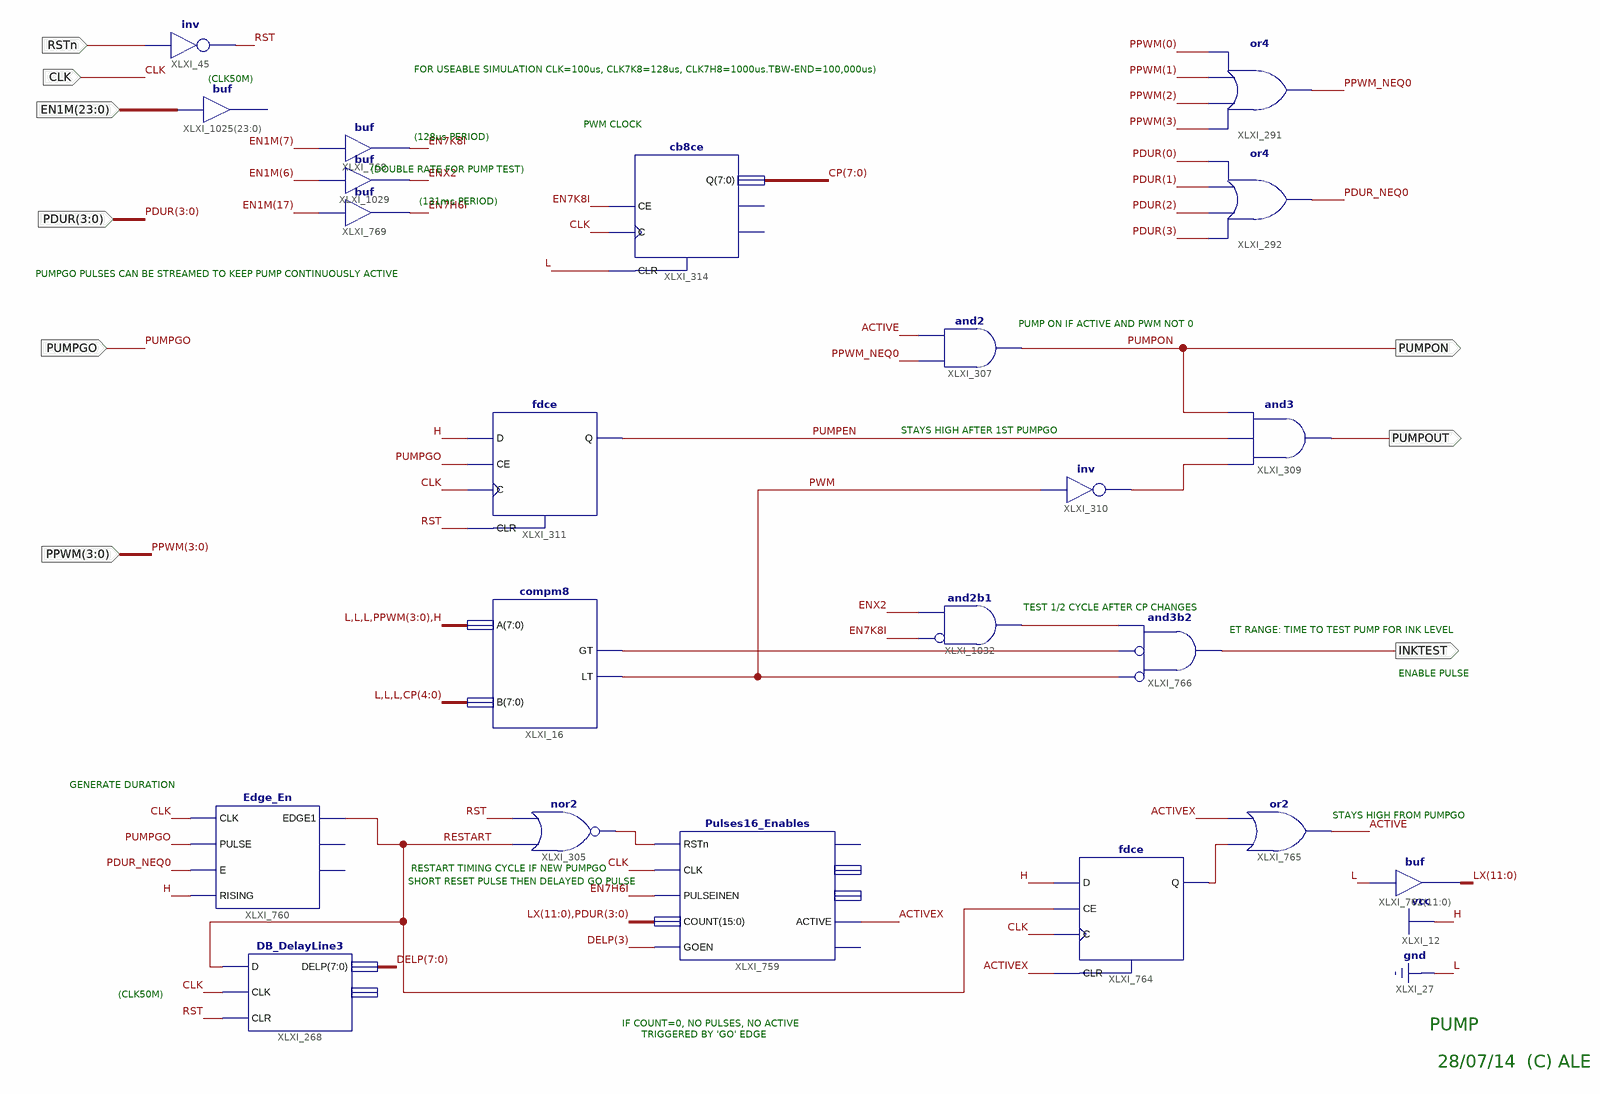
[diagram p0: schematic sheet 1]
// Xilinx ISE schematic DB_Pump.sch (spartan3e) as structural Verilog: 22 symbols, 9 ports
module DB_Pump (
  input  PUMPGO,
  input  [3:0] PDUR,
  input  CLK,
  input  RSTn,
  input  [3:0] PPWM,
  input  [23:0] EN1M,
  output PUMPON,
  output PUMPOUT,
  output INKTEST
);

  wire ACTIVE, ACTIVEX, EN7H6I, EN7K8I, ENX2, PDUR_NEQ0, PPWM_NEQ0, PUMPEN, PWM, RESTART, RST, XLXN_63,
       XLXN_330, XLXN_335, XLXN_336, XLXN_339;
  wire [7:0] CP, DELP;
  wire [11:0] LX;

  not XLXI_45 (RST, RSTn);
  compm8 XLXI_16 (.A({3'b000, PPWM, 1'b1}), .B({3'b000, CP[4:0]}), .GT(XLXN_336), .LT(PWM));
  DB_DelayLine3 XLXI_268 (.CLK(CLK), .CLR(RST), .D(RESTART), .DELP(DELP));  // open: DELN
  nor XLXI_305 (XLXN_330, RESTART, RST);
  and XLXI_307 (PUMPON, PPWM_NEQ0, ACTIVE);
  and XLXI_309 (PUMPOUT, XLXN_63, PUMPEN, PUMPON);
  not XLXI_310 (XLXN_63, PWM);
  or XLXI_291 (PPWM_NEQ0, PPWM[3], PPWM[2], PPWM[1], PPWM[0]);
  or XLXI_292 (PDUR_NEQ0, PDUR[3], PDUR[2], PDUR[1], PDUR[0]);
  cb8ce XLXI_314 (.C(CLK), .CE(EN7K8I), .CLR(1'b0), .Q(CP));  // open: CEO, TC
  fdce XLXI_311 (.C(CLK), .CE(PUMPGO), .CLR(RST), .D(1'b1), .Q(PUMPEN));
  Edge_En XLXI_760 (
    .CLK(CLK), .E(PDUR_NEQ0), .EDGE1(RESTART), .PULSE(PUMPGO), .RISING(1'b1));  // open: EDGE0, EDGEQUICK
  Pulses16_Enables XLXI_759 (
    .ACTIVE(ACTIVEX), .CLK(CLK), .COUNT({LX, PDUR}), .GOEN(DELP[3]), .PULSEINEN(EN7H6I), .RSTn(XLXN_330));  // open: COUNTUP, PULSEOUT, PULSEOUTEN, TCNT
  fdce XLXI_764 (.C(CLK), .CE(RESTART), .CLR(ACTIVEX), .D(1'b1), .Q(XLXN_335));
  or XLXI_765 (ACTIVE, XLXN_335, ACTIVEX);
  assign LX = {12{1'b0}};  // buf XLXI_762[11..0], 12 bits wide
  and XLXI_766 (INKTEST, ~PWM, ~XLXN_336, XLXN_339);  // and3b2
  // buf XLXI_1025[23..0] has open pins: I=EN1M, O=open
  buf XLXI_768 (EN7K8I, EN1M[7]);
  buf XLXI_769 (EN7H6I, EN1M[17]);
  buf XLXI_1029 (ENX2, EN1M[6]);
  and XLXI_1032 (XLXN_339, ~EN7K8I, ENX2);  // and2b1

  // Notes on the sheet:
  //   FOR USEABLE SIMULATION CLK=100us, CLK7K8=128us, CLK7H8=1000us.TBW-END=100,000us)
  //   (CLK50M)
  //   PWM CLOCK
  //   (128us PERIOD)
  //   (DOUBLE RATE FOR PUMP TEST)
  //   (131ms PERIOD)
  //   PUMPGO PULSES CAN BE STREAMED TO KEEP PUMP CONTINUOUSLY ACTIVE
  //   PUMP ON IF ACTIVE AND PWM NOT 0
  //   STAYS HIGH AFTER 1ST PUMPGO
  //   TEST 1/2 CYCLE AFTER CP CHANGES
  //   ET RANGE: TIME TO TEST PUMP FOR INK LEVEL
  //   ENABLE PULSE
  //   GENERATE DURATION
  //   STAYS HIGH FROM PUMPGO
  //   RESTART TIMING CYCLE IF NEW PUMPGO
  //   SHORT RESET PULSE THEN DELAYED GO PULSE
  //   (CLK50M)
  //   IF COUNT=0, NO PULSES, NO ACTIVE
  //   PUMP
  //   TRIGGERED BY 'GO' EDGE
  //   28/07/14  (C) ALE
endmodule
